# Altium project Pmod_SSD_Design.PrjPcb
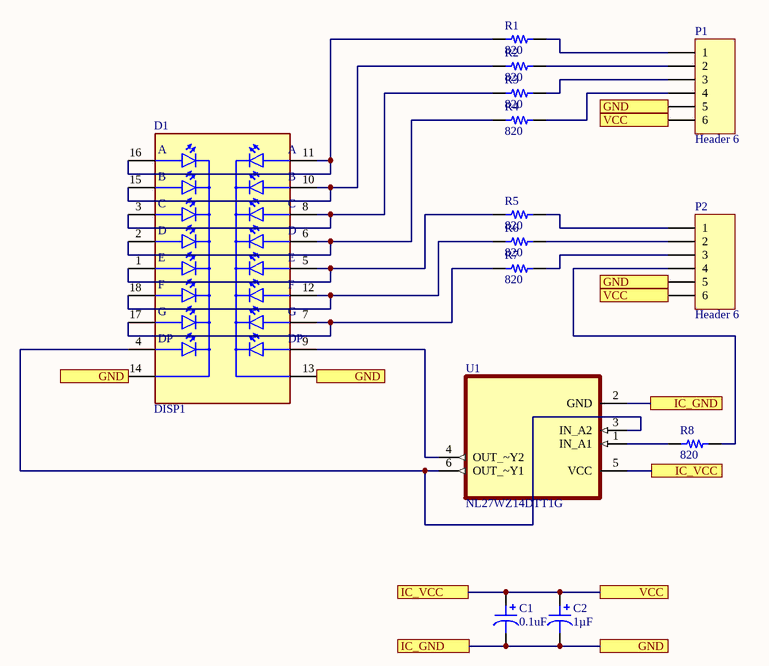
[diagram p0: Sheet1.SchDoc]
1 sheet, 14 parts. Net scope: flat (ports and power ports of the same name join across sheets).
Board file: PMOD_SSD.PcbDoc

## Sheet Sheet1.SchDoc
size A4; SheetNumber: 1; SheetTotal: 1

### Parts
C1  0.1uF  [CAP TH ALUM ELEC D5.00mm S2.00mm H12.00mm]
C2  1µF  [CAP TH ALUM ELEC D5.00mm S2.00mm H12.00mm]
D1  DISP1  [LED_HDSP-523G]
P1  Header 6  [HDR1X6]
P2  Header 6  [HDR1X6]
R1  820  [RES 0805_2012]
R2  820  [RES 0805_2012]
R3  820  [RES 0805_2012]
R4  820  [RES 0805_2012]
R5  820  [RES 0805_2012]
R6  820  [RES 0805_2012]
R7  820  [RES 0805_2012]
R8  820  [RES 0805_2012]
U1  NL27WZ14DTT1G  [SOT95P275X110-6N]

### Ports
GND (see Sheet1[1B], Sheet1[2A], Sheet1[2B]), GND (see Sheet1[1B], Sheet1[2A], Sheet1[2B], Sheet1[2C]), GND (see Sheet1[1B], Sheet1[2B], Sheet1[2C]), GND (see Sheet1[2A], Sheet1[2B], Sheet1[2C]), IC_GND (see Sheet1[2C]), IC_GND (see Sheet1[3B]), IC_VCC (see Sheet1[2C]), IC_VCC (see Sheet1[3C]), VCC (see Sheet1[2A], Sheet1[2B]), VCC (see Sheet1[2A], Sheet1[2C]), VCC (see Sheet1[2B], Sheet1[2C])

### Nets
NetC1_1: C1.1 C2.1 P1.6 P2.6 U1.5(VCC) ; port VCC, port IC_VCC
NetC1_2: C1.2 C2.2 D1.13(COM2) D1.14(COM1) P1.5 P2.5 U1.2(GND) ; port GND, port IC_GND
NetD1_1: D1.1(E1) D1.5(E2) R5.1
NetD1_2: D1.2(D1) D1.6(D2) R4.1
NetD1_3: D1.3(C1) D1.8(C2) R3.1
NetD1_4: D1.4(DP1) U1.3(IN_A2) U1.6(OUT_~Y1)
NetD1_7: D1.7(G2) D1.17(G1) R7.1
NetD1_9: D1.9(DP2) U1.4(OUT_~Y2)
NetD1_10: D1.10(B2) D1.15(B1) R2.1
NetD1_11: D1.11(A2) D1.16(A1) R1.1
NetD1_12: D1.12(F2) D1.18(F1) R6.1
NetP1_1: P1.1 R1.2
NetP1_2: P1.2 R2.2
NetP1_3: P1.3 R3.2
NetP1_4: P1.4 R4.2
NetP2_1: P2.1 R5.2
NetP2_2: P2.2 R6.2
NetP2_3: P2.3 R7.2
NetP2_4: P2.4 R8.2
NetR8_1: R8.1 U1.1(IN_A1)

### Notes on the sheet
- (in symbol HDSP-523G) A; B; C; D; E; F; G; DP

### Library data of the parts
C1 = UKL2A010KDD: CAP ALUM 1UF 10% 100V RADIAL; manufacturer: Nichicon; Capacitance: 1µF; Lifetime @ Temp.: 2000 Hrs @ 85°C; Polarization: Polar; Ripple Current @ High Frequency: 38mA @ 10kHz; Ripple Current @ Low Frequency: 19mA @ 120Hz; value: 1µF; Part Number: UKL2A010KDD; Applications: General Purpose; componentlink1description: Datasheet; componentlink1url: http://nichicon-us.com/english/products/pdfs/e-ukl.pdf; componentlink2description: DigiKey Link; componentlink2url: http://digikey.com/product-detail/en/nichicon/UKL2A010KDD/493-15407-ND/2598552; Device Package: Radial, Can; Height - Seated (Max): 0.472" (12.00mm); lastupdated: 4.09.2020 23:28:57; Lead Spacing: 0.079" (2.00mm); Lifecycle Status: Active; Minimum Order: 1; Mounting Type: Through Hole; Operating Temperature: -40°C ~ 85°C; Package / Case: Radial, Can; packaging: Bulk; partid: 21600; Part Status: Active; price: 0.35; series: UKL; Size / Dimension: 0.197" Dia (5.00mm); Supplier 1: DigiKey; Supplier Part Number 1: 493-15407-ND; Tolerance: ±10%; Voltage - Rated: 100V
C2 = UKL2A010KDD: CAP ALUM 1UF 10% 100V RADIAL; manufacturer: Nichicon; Lifetime @ Temp.: 2000 Hrs @ 85°C; Polarization: Polar; Ripple Current @ High Frequency: 38mA @ 10kHz; Ripple Current @ Low Frequency: 19mA @ 120Hz; Part Number: UKL2A010KDD; Applications: General Purpose; Capacitance: 1µF; componentlink1description: Datasheet; componentlink1url: http://nichicon-us.com/english/products/pdfs/e-ukl.pdf; componentlink2description: DigiKey Link; componentlink2url: http://digikey.com/product-detail/en/nichicon/UKL2A010KDD/493-15407-ND/2598552; Device Package: Radial, Can; Height - Seated (Max): 0.472" (12.00mm); lastupdated: 4.09.2020 23:28:57; Lead Spacing: 0.079" (2.00mm); Lifecycle Status: Active; Minimum Order: 1; Mounting Type: Through Hole; Operating Temperature: -40°C ~ 85°C; Package / Case: Radial, Can; packaging: Bulk; partid: 21600; Part Status: Active; price: 0.35; series: UKL; Size / Dimension: 0.197" Dia (5.00mm); Supplier 1: DigiKey; Supplier Part Number 1: 493-15407-ND; Tolerance: ±10%; value: 1µF; Voltage - Rated: 100V
D1 = HDSP-523G: Display Modules - LED Character and Numeric Green 7-Segment 2 Character Common Cathode 2V 10mA 0.732 H x 0.984 W x 0.315 D (18.60mm x 25.00mm x 8.00mm) 18-DIP (0.600, 15.24mm); MF: Broadcom Limited; Check_prices: https://www.snapeda.com/parts/HDSP-523G/Broadcom+Limited/view-part/?ref=eda; Availability: In Stock; Price: None; Package: None; Value: *; Purchase-URL: https://pricing.snapeda.com/search/part/HDSP-523G/?ref=eda; SnapEDA_Link: https://www.snapeda.com/parts/HDSP-523G/Broadcom+Limited/view-part/?ref=snap; MP: HDSP-523G
P1 P2 = Header 6: Header, 6-Pin; LatestRevisionDate: 17-Jul-2002; LatestRevisionNote: Re-released for DXP Platform.; Publisher: Altium Limited
R1-R8 = RNCS0805BKE49R9: RES 49.9 OHM 0.1% 1/10W 0805; Manufacturer: Stackpole Electronics Inc; Power (Watts): 0.1W, 1/10W; Resistance: 49.9 Ohms; Temperature Coefficient: ±25ppm/°C; Part Number: RNCS0805BKE49R9; Value: 820; ComponentLink1Description: Datasheet; ComponentLink1URL: https://www.seielect.com/catalog/sei-rncs_rnch.pdf; ComponentLink2Description: DigiKey Link; ComponentLink2URL: https://www.digikey.com/en/products/detail/stackpole-electronics-inc/RNCS0805BKE49R9/1800098; Composition: Thin Film; Device Package: 0805 (2012 Metric); Features: Anti-Corrosive, Automotive AEC-Q200, Moisture Resistant; Height - Seated (Max): 0.026" (0.65mm); LastUpdated: 9.06.2023 19:55:35; Lifecycle Status: Active; Minimum Order: 1; Number of Terminations: 2; Operating Temperature: -55°C ~ 155°C; Package / Case: 0805 (2012 Metric); Packaging: TapeAndReel; PartId: 27719; Part Status: Active; Price: 0.07; Ratings: AEC-Q200; Series: RNCS; Size / Dimension: 0.079" L x 0.049" W (2.00mm x 1.25mm); Supplier 1: DigiKey; Supplier Part Number 1: RNCS0805BKE49R9CT-ND; Supplier Device Package: 0805; Tolerance: ±0.1%
U1 = NL27WZ14DTT1G: Inverter IC 2 Channel Schmitt Trigger 6-TSOP; MF: ON Semiconductor; Package: TSOP-6 ON Semiconductor; Price: None; Check_prices: https://www.snapeda.com/parts/NL27WZ14DTT1G/ON%20Semiconductor/view-part/292209/?ref=eda; Value: *; MP: NL27WZ14DTT1G; SnapEDA_Link: https://www.snapeda.com/parts/NL27WZ14DTT1G/ON%20Semiconductor/view-part/292209/?ref=snap; Availability: In Stock